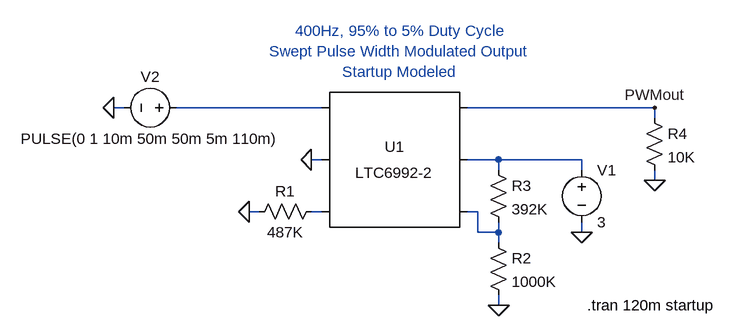
[diagram p0: schematic 6992-2.asc]
6992-2.asc, the LTspice schematic file:
Version 4
SHEET 1 888 680
WIRE -208 96 -224 96
WIRE 96 96 -128 96
WIRE 608 96 320 96
WIRE 608 112 608 96
WIRE 96 176 80 176
WIRE 368 176 320 176
WIRE 496 176 368 176
WIRE 368 192 368 176
WIRE 496 192 496 176
WIRE 608 208 608 192
WIRE 0 256 -16 256
WIRE 96 256 80 256
WIRE 336 256 320 256
WIRE 336 288 336 256
WIRE 368 288 368 272
WIRE 368 288 336 288
WIRE 496 288 496 272
WIRE 368 304 368 288
WIRE 368 400 368 384
FLAG -224 96 0
FLAG 496 288 0
FLAG 80 176 0
FLAG -16 256 0
FLAG 368 400 0
FLAG 608 208 0
FLAG 608 96 PWMout
SYMBOL res 96 240 R90
WINDOW 0 0 56 VBottom 2
WINDOW 3 32 56 VTop 2
SYMATTR InstName R1
SYMATTR Value 487K
SYMBOL res 352 288 R0
SYMATTR InstName R2
SYMATTR Value 1000K
SYMBOL res 352 176 R0
SYMATTR InstName R3
SYMATTR Value 392K
SYMBOL res 592 96 R0
SYMATTR InstName R4
SYMATTR Value 10K
SYMBOL voltage 496 176 R0
WINDOW 123 0 0 Left 2
WINDOW 39 0 0 Left 2
SYMATTR InstName V1
SYMATTR Value 3
SYMBOL voltage -112 96 R90
WINDOW 123 74 56 VTop 2
WINDOW 39 53 56 VTop 2
WINDOW 3 32 56 VTop 2
WINDOW 0 -32 56 VBottom 2
SYMATTR Value PULSE(0 1 10m 50m 50m 5m 110m)
SYMATTR InstName V2
SYMBOL SpecialFunctions\\LTC6992-2 208 176 R0
SYMATTR InstName U1
TEXT 504 400 Left 2 !.tran 120m startup
TEXT 216 56 Bottom 2 ;400Hz, 95% to 5% Duty Cycle\nSwept Pulse Width Modulated Output\nStartup Modeled

The netlist it stands for:
* 6992-2.asc
R1 N003 0 487K
R2 N004 0 1000K
R3 N002 N004 392K
R4 PWMout 0 10K
V1 N002 0 3
V2 N001 0 PULSE(0 1 10m 50m 50m 5m 110m)
XU1 N001 0 N003 N004 N002 PWMout LTC6992-2
.tran 120m startup
* 400Hz, 95% to 5% Duty Cycle
* Swept Pulse Width Modulated Output
* Startup Modeled
.lib LTC6992-2.sub
.backanno
.end